# EAGLE design bdm_pod (EAGLE 4.13)
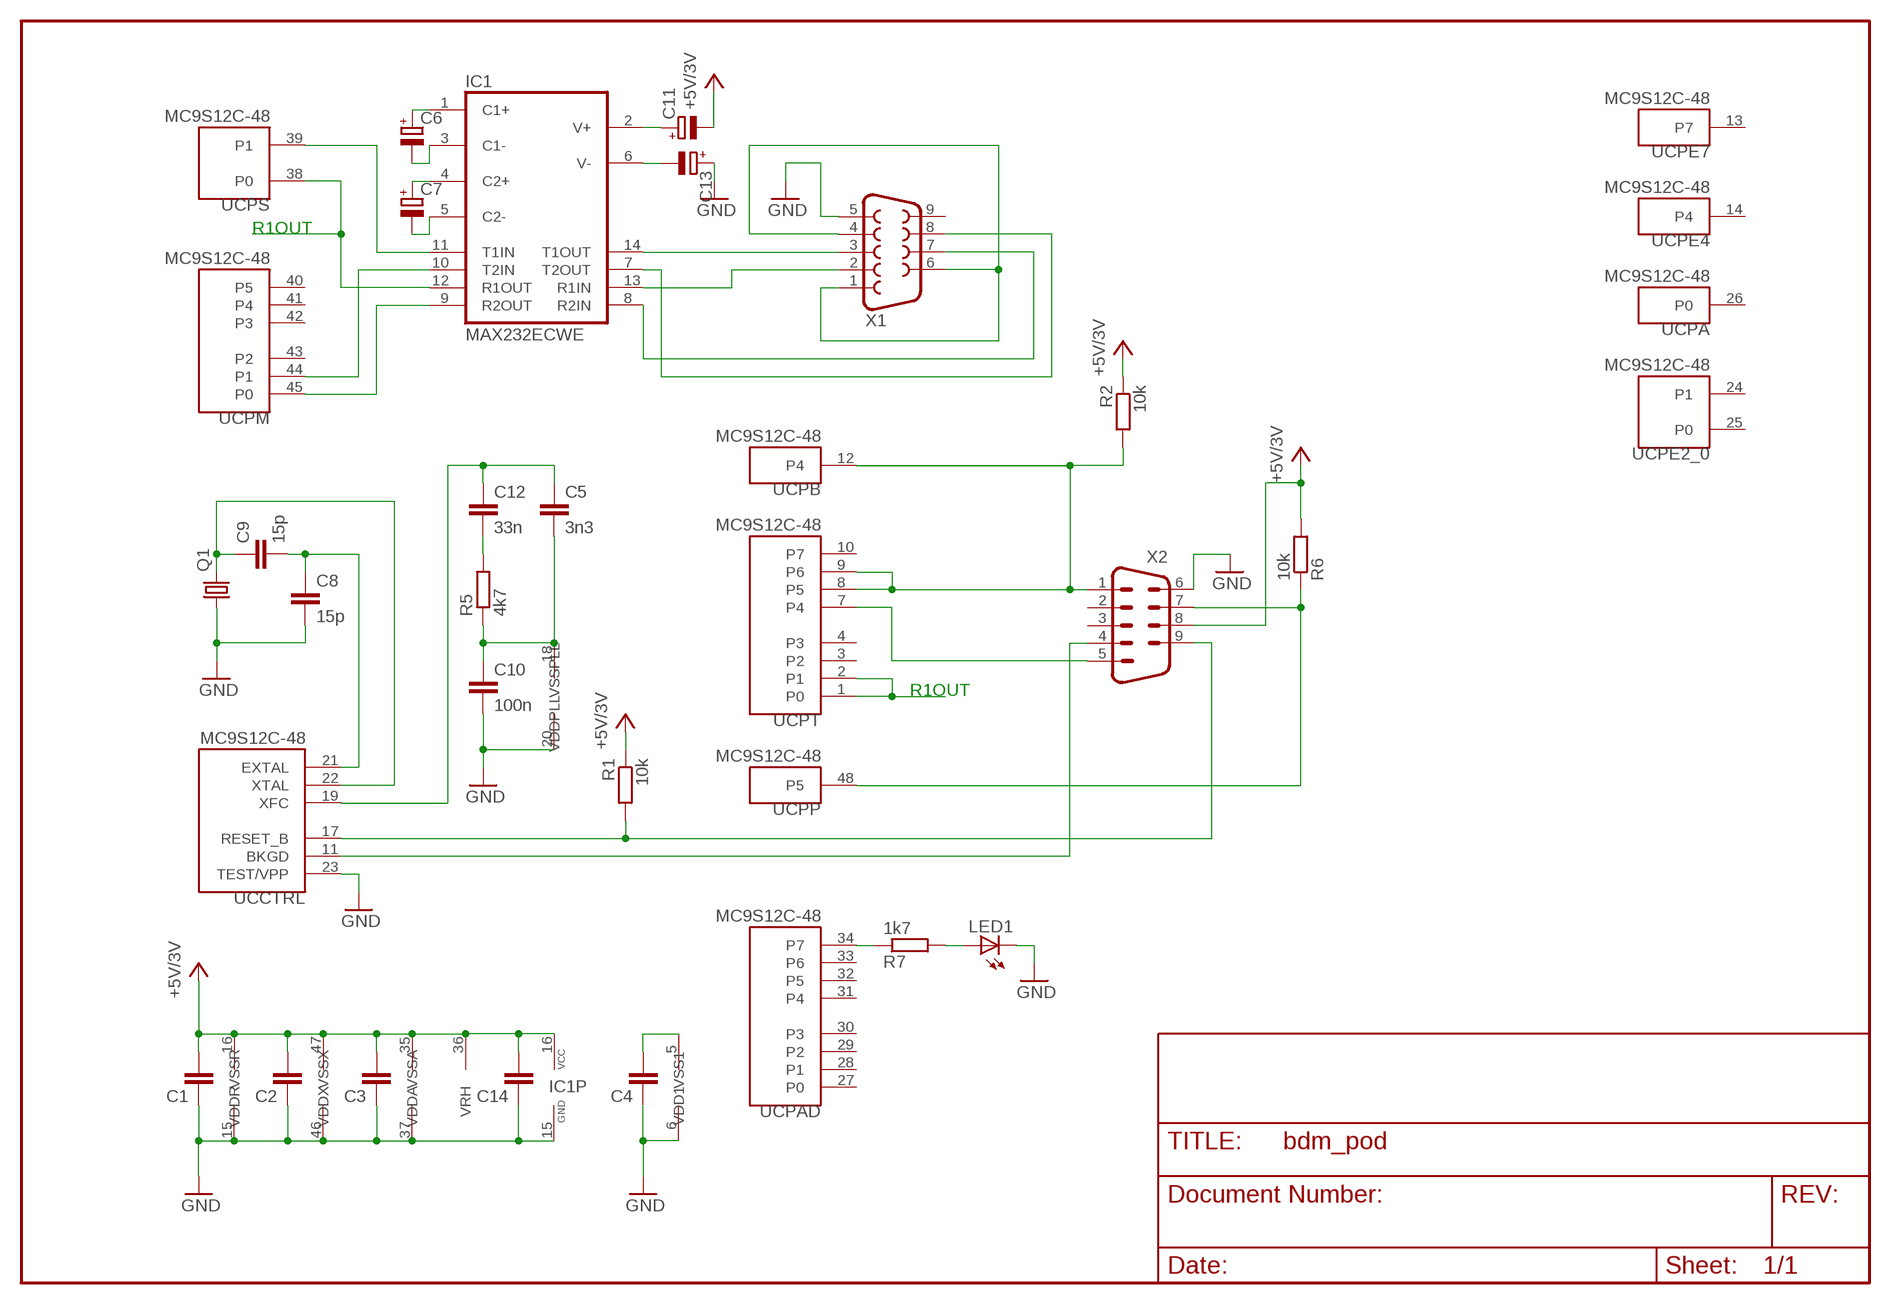
[diagram p0: schematic, sheet 1]

## Parts
C1  C-EUC0805  [C0805]
C2  C-EUC0805  [C0805]
C3  C-EUC0805  [C0805]
C4  C-EUC0805  [C0805]
C5  3n3  C-EUC0805  [C0805]
C6  CPOL-EUA  [PANASONIC_A]
C7  CPOL-EUA  [PANASONIC_A]
C8  15p  C-EUC0805  [C0805]
C9  15p  C-EUC0805  [C0805]
C10  100n  C-EUC0805  [C0805]
C11  CPOL-EUA  [PANASONIC_A]
C12  33n  C-EUC0805  [C0805]
C13  CPOL-EUA  [PANASONIC_A]
C14  C-EUC0805  [C0805]
IC1  MAX232ECWE  [SO16L]
LED1  LED3MM  [LED3MM]
Q1  CRYTALHC49S  [HC49/S]
R1  10k  R-EU_R0805  [R0805]
R2  10k  R-EU_R0805  [R0805]
R5  4k7  R-EU_R0805  [R0805]
R6  10k  R-EU_R0805  [R0805]
R7  1k7  R-EU_R0805  [R0805]
UC  MC9S12C-48  [TQFP48]
X1  F09D  [F09D]
X2  M09D  [M09D]

## Nets
+5V: C1.2 C2.2 C3.2 C11.- C14.2 IC1.16(VCC) R1.1 R2.1 R6.2 UC.16(VDD_VSS:VDDR) UC.35(VDDA_VSSA:VDDA) UC.36(VRH:VRH) UC.47(VDDX_VSSX:VDDX) X2.8 ; supply symbol labelled +5V/3V
GND: C1.1 C2.1 C3.1 C4.1 C8.2 C10.2 C13.+ C14.1 IC1.15(GND) LED1.K(C) Q1.1 UC.6(VDD1_VSS1:VSS1) UC.15(VDD_VSS:VSSR) UC.20(VDDPLL_VSSPLL:VSSPLL) UC.23(CTRL:TEST/VPP) UC.37(VDDA_VSSA:VSSA) UC.46(VDDX_VSSX:VSSX) X1.5 X2.6
N$1: R7.1 UC.34(PAD:P7)
N$2: UC.11(CTRL:BKGD) X2.4
N$3: LED1.A R7.2
N$6: C9.1 Q1.2 UC.22(CTRL:XTAL)
N$7: C12.2 R5.2
N$8: C11.+ IC1.2(V+)
N$9: C5.1 C12.1 UC.19(CTRL:XFC)
N$10: C13.- IC1.6(V-)
N$11: C7.+ IC1.4(C2+)
N$12: C7.- IC1.5(C2-)
N$13: C6.- IC1.3(C1-)
N$14: C6.+ IC1.1(C1+)
N$15: IC1.11(T1IN) UC.39(PS:P1)
N$16: IC1.14(T1OUT) X1.3
N$17: IC1.9(R2OUT) UC.45(PM:P0)
N$18: IC1.10(T2IN) UC.44(PM:P1)
N$19: IC1.13(R1IN) X1.2
N$20: X1.1 X1.4 X1.6
N$21: IC1.8(R2IN) X1.7
N$22: IC1.7(T2OUT) X1.8
N$23: R6.1 UC.48(PP:P5) X2.7
N$24: R2.2 UC.8(PT:P5) UC.9(PT:P6) UC.12(PB:P4) X2.1
N$25: UC.7(PT:P4) X2.5
N$26: C8.1 C9.2 UC.21(CTRL:EXTAL)
R1OUT: IC1.12(R1OUT) UC.1(PT:P0) UC.2(PT:P1) UC.38(PS:P0)
RESET_B: R1.2 UC.17(CTRL:RESET_B) X2.9
VDD1: C4.2 UC.5(VDD1_VSS1:VDD1)
VDDPLL: C5.2 C10.1 R5.1 UC.18(VDDPLL_VSSPLL:VDDPLL)
Unconnected: UC.3(PT:P2) UC.4(PT:P3) UC.10(PT:P7) UC.13(PE7:P7) UC.14(PE4:P4) UC.24(PE2_0:P1) UC.25(PE2_0:P0) UC.26(PA:P0) UC.27(PAD:P0) UC.28(PAD:P1) UC.29(PAD:P2) UC.30(PAD:P3) UC.31(PAD:P4) UC.32(PAD:P5) UC.33(PAD:P6) UC.40(PM:P5) UC.41(PM:P4) UC.42(PM:P3) UC.43(PM:P2) X1.9 X2.2 X2.3

## Notes on the sheet
- R1OUT
- R1OUT

## Library data of the parts
C1-C5 C8-C10 C12 C14 = rcl:C-EU: CAPACITOR, European symbol
C6 C7 C11 C13 = rcl:CPOL-EU: POLARIZED CAPACITOR, European symbol
IC1 = maxim:MAX232ECWE: RS232 TRANSEIVER
LED1 = led:LED: LED OSRAM: - CHIPLED LG R971, LG N971, LY N971, LG Q971, LY Q971, LO R971, LY R971 LH N974, LH R974 LS Q976, LO Q976, LY Q976 LO Q996 - Hyper CHIPLED LW Q18S LB Q993, LB Q99A, LB R99A - SideLED LS A670, LO A670, LY A670, LG A670, LP A670 LB A673, LV A673, LT A673, LW A673 LH A674 LY A675 LS A676, LA A676, LO A676, LY A676, LW A676 LS A679, LY A679, LG A679 - Hyper Micro SIDELED® LS Y876, LA Y876, LO Y876, LY Y876 LT Y87S - SmartLED LW L88C, LW L88S LB L89C, LB L89S, LG L890 LS L89K, LO L89K, LY L89K LS L896, LA L896, LO L896, LY L896 - TOPLED LS T670, LO T670, LY T670, LG T670, LP T670 LSG T670, LSP T670, LSY T670, LOP T670, LYG T670 LG T671, LOG T671, LSG T671 LB T673, LV T673, LT T673, LW T673 LH T674 LS T676, LA T676, LO T676, LY T676, LB T676, LH T676, LSB T676, LW T676 LB T67C, LV T67C, LT T67C, LS T67K, LO T67K, LY T67K, LW E67C LS E67B, LA E67B, LO E67B, LY E67B, LB E67C, LV E67C, LT E67C LW T67C LS T679, LY T679, LG T679 LS T770, LO T770, LY T770, LG T770, LP T770 LB T773, LV T773, LT T773, LW T773 LH T774 LS E675, LA E675, LY E675, LS T675 LS T776, LA T776, LO T776, LY T776, LB T776 LHGB T686 LT T68C, LB T68C - Hyper Mini TOPLED® LB M676 - Mini TOPLED Santana® LG M470 LS M47K, LO M47K, LY M47K Source: http://www.osram.convergy.de/
Q1 = crystal:CRYTAL: CRYSTAL
R1 R2 R5-R7 = rcl:R-EU_: RESISTOR, European symbol
UC = misc:MC9S12C-48
X1 = con-subd:F09: SUB-D
X2 = con-subd:M09: SUB-D

## Board
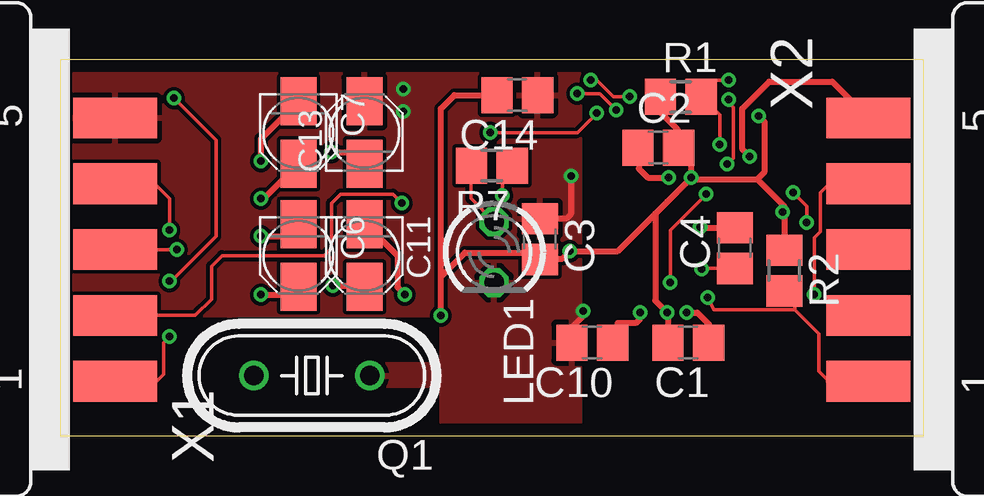
[diagram p1: board, top side]
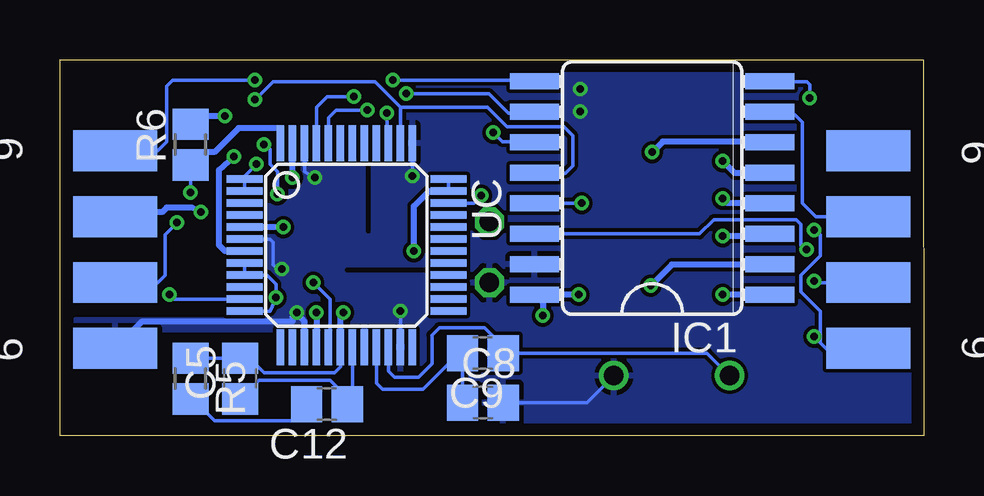
[diagram p2: board, bottom side, seen from below]

Size 36 x 15.65 mm. Coordinates in mm from the lower left corner, seen from the top.
Outline: 0,0 36,0 36,15.65 0.01,15.65 0,0
Copper layers (1*16): Top 0.035mm / dielectric 1.5mm / Bottom 0.035mm
Design rules "PCB-POOL": minimum track width 6mil, minimum drill 12mil, track to track 6mil, track to pad 6mil, pad to pad 6mil, via to via 6mil, smd to smd 6mil, copper to edge 20mil, drill to drill 8mil, minimum pad ring 8mil, minimum via ring 6mil, stop-mask expansion 3mil, vias tented up to drill 0mil, thermal gap 8mil
bRestrict: area 23.1,8.5 to 23.2,11.2; area 20.8,6.9 to 24.1,6.9

### Footprints (pad centres in the part's own frame; a part is rotated, then mirrored left to right if it is on the bottom)
C0805 = smd 1.3 x 1.5: 1 -0.85,0; 2 0.85,0
PANASONIC_A = smd 2 x 1.5: + 1.3,0; - -1.3,0
SO16L = smd 0.66 x 2.032: 1 -4.445,-4.902; 2 -3.175,-4.902; 3 -1.905,-4.902; 4 -0.635,-4.902; 5 0.635,-4.902; 6 1.905,-4.902; 7 3.175,-4.902; 8 4.445,-4.902; 9 4.445,4.902; 10 3.175,4.902; 11 1.905,4.902; 12 0.635,4.902; 13 -0.635,4.902; 14 -1.905,4.902; 15 -3.175,4.902; 16 -4.445,4.902
LED3MM = drill 0.813 octagon: A -1.27,0; K 1.27,0
HC49/S = drill 0.813 round: 1 -2.413,0; 2 2.413,0
R0805 = smd 1.3 x 1.5: 1 -0.85,0; 2 0.85,0
TQFP48 = smd 0.3 x 1.5: 1 -2.75,-4.25; 2 -2.25,-4.25; 3 -1.75,-4.25; 4 -1.25,-4.25; 5 -0.75,-4.25; 6 -0.25,-4.25; 7 0.25,-4.25; 8 0.75,-4.25; 9 1.25,-4.25; 10 1.75,-4.25; 11 2.25,-4.25; 12 2.75,-4.25; 25 2.75,4.25; 26 2.25,4.25; 27 1.75,4.25; 28 1.25,4.25; 29 0.75,4.25; 30 0.25,4.25; 31 -0.25,4.25; 32 -0.75,4.25; 33 -1.25,4.25; 34 -1.75,4.25; 35 -2.25,4.25; 36 -2.75,4.25 | smd 1.5 x 0.3: 13 4.25,-2.75; 14 4.25,-2.25; 15 4.25,-1.75; 16 4.25,-1.25; 17 4.25,-0.75; 18 4.25,-0.25; 19 4.25,0.25; 20 4.25,0.75; 21 4.25,1.25; 22 4.25,1.75; 23 4.25,2.25; 24 4.25,2.75; 37 -4.25,2.75; 38 -4.25,2.25; 39 -4.25,1.75; 40 -4.25,1.25; 41 -4.25,0.75; 42 -4.25,0.25; 43 -4.25,-0.25; 44 -4.25,-0.75; 45 -4.25,-1.25; 46 -4.25,-1.75; 47 -4.25,-2.25; 48 -4.25,-2.75
F09D = smd 1.7 x 3.5: 1 -5.486,-6.045; 2 -2.743,-6.045; 3 0,-6.045; 4 2.743,-6.045; 5 5.486,-6.045 | smd 1.7 x 3.5 bottom: 6 -4.115,-6.045; 7 -1.372,-6.045; 8 1.372,-6.045; 9 4.115,-6.045
M09D = smd 1.7 x 3.5: 1 5.486,-6.045; 2 2.743,-6.045; 3 0,-6.045; 4 -2.743,-6.045; 5 -5.486,-6.045 | smd 1.7 x 3.5 bottom: 6 4.115,-6.045; 7 1.372,-6.045; 8 -1.372,-6.045; 9 -4.115,-6.045

### Placement (x,y rotation side)
C1  26.19,3.88 180 top
C2  24.94,12 0 top
C3  20,8.19 270 top
C4  28.12,7.81 90 top
C5  28.49,2.38 90 bottom
C6  9.94,7.5 270 top
C7  9.94,12.62 270 top
C8  18.38,1.38 0 bottom
C9  18.38,3.44 180 bottom
C10  22.19,3.88 180 top
C11  12.69,7.5 270 top
C12  24.88,1.31 180 bottom
C13  12.69,12.62 90 top
C14  19.06,14.19 180 top
IC1  11.31,10.31 90 bottom
LED1  18.1,7.64 270 top
Q1  10.5,2.5 180 top
R1  25.88,14.12 0 top
R2  30.19,6.88 270 top
R5  30.56,2.38 270 bottom
R6  30.56,12.12 90 bottom
R7  18,11.25 180 top
UC  24.06,7.94 270 bottom
X1  -3.75,7.75 90 top
X2  39.75,7.75 270 top

### Tracks (layer width: path | path; a pad name or v marks a point on that pad's centre or on a via)
+5V  (via drill 0.3 pad 0.15)
  Top 0.152: v25.31,5.12 25.34,5.04 | 26.31,11.5 25.81,12 | C3.2 20,7.38 | 25.02,13.47 R1.1 | 25.81,12 C2.2 | 25.75,12.75 25.75,12.06 25.81,12
  Top 0.254: 25.34,5.04 C1.2 | v26.31,10.75 26.31,11.5 | 20,7.38 20.94,7.38 v21.25,7.69 23.25,7.69 25.31,9.75 | v26.31,10.75 26.31,10.69 29.06,10.69 | 25.31,9.75 24.81,9.25 24.81,5.62 v25.31,5.12 | 25.31,9.75 v26.31,10.75 | 29.06,10.69 29.38,11 29.38,13.06 v29.12,13.31 | 30.19,9.31 30.19,9.56 29.06,10.69 | 30.19,9.31 v30.12,9.31 | 30.19,9.31 R2.1 | 25.75,12.75 25.02,13.47 | C14.2 16.44,14.19 15.88,13.62 v15.88,5 15.88,6.62 16.88,7.62 19.69,7.62 20,7.31 C3.2 | v14.38,5.88 14.06,6.19 14.06,7.5 12.81,8.75 12.64,8.75 | 12.64,8.75 12.62,8.75 | C11.- 12.64,8.75
  Bottom 0.152: UC.36 UC.35 20.62,10.19
  Bottom 0.254: v25.31,5.12 UC.16 | v26.31,10.75 UC.47 | 20.62,10.19 21.25,9.56 v21.25,7.69 | X2.8 33.51,9.31 31.75,9.31 31.56,9.5 30.5,9.5 v30.12,9.31 | R6.2 30.56,13 30,13.31 v29.12,13.31 | 16.25,5.88 16.24,5.87 IC1.16 | IC1.16 14.38,5.87 v14.38,5.88 | IC1.16 15.88,5.53 v15.88,5
GND  (via drill 0.3 pad 0.15)
  Top 0.152: 21.81,5 v21.81,5.19 | C10.2 21.31,3.88 21.31,4.5 | 27.06,3.88 C1.1 | C4.1 26.77,6.96 v26.75,6.94 | C2.1 24.12,12 | C3.1 20,9.06
  Top 0.254: 21.31,4.5 21.81,5 | v26.12,5.12 26.56,5.12 27.06,4.62 27.06,3.88 | v25.38,10.75 24.5,10.75 24.12,11.12 24.12,12 | v21.31,10.81 21.31,9.25 21.12,9.06 20,9.06
  Bottom 0.152: Q1.1 14.04,1.38 C8.2 | v21.81,5.19 UC.23 | v26.75,6.94 26.94,6.94 27.12,7.12 27.12,8.06 27.25,8.19 UC.6 | UC.46 25.81,11 v25.38,10.75 | v21.31,10.81 UC.37
  Bottom 0.254: UC.15 25.81,4.75 v26.12,5.12 26.31,4.94 26.31,4.75 32.59,4.75 X2.6
  other vias: 14.31,14.44 14.31,13.5
  pour Bottom: 20.56,10.81 20.56,5.06 21.19,4.44 26.94,4.44 27.56,5.06 27.56,10.81 26.94,11.44 21.19,11.44
  pour Bottom: 0,15.62 0,0 15.88,0 21.94,0 21.94,15.62
  pour Top: 0,15.62 0,0 5.19,0 5.19,5 15.88,5 15.88,3 12.38,3 12.38,2.06 15.88,2.06 15.88,0 21.69,0 21.69,15.69 0.06,15.69
  pour Bottom: 27.19,4.38 32.06,4.38 32.06,3.19 35.38,3.19 35.38,4.88 27.19,4.88
N$1  (via drill 0.3 pad 0.15)
  Top 0.152: R7.1 18.85,11.22 18.44,10.81 v18.44,10
  Bottom 0.152: UC.34 18.75,9.69 v18.44,10
N$2  (via drill 0.3 pad 0.15)
  Top 0.152: v31.44,5.88 31.44,8.25 31.69,8.5 31.69,10.12 32,10.44 33.69,10.44 33.74,10.49 | 33.74,10.49 33.75,10.5 | 33.74,10.49 X2.4
  Bottom 0.152: UC.11 31.25,5.69 v31.44,5.88
N$3
  Top 0.152: R7.2 17.12,11.25 17.12,9.88 LED1.A
N$6
  Bottom 0.152: Q1.2 9.02,3.44 C9.1 | 17.52,3.71 18.31,4.5 20.19,4.5 20.5,4.19 20.5,3 21.06,2.44 22.06,2.44 22.31,2.69 UC.22
  Bottom 0.254: C9.1 17.52,3.4 | C9.1 17.52,3.84 | C9.1 17.52,3.71
N$7
  Bottom 0.152: R5.2 30.46,1.52 29.56,0.62 26.38,0.62 25.69,1.31 C12.2
N$8  (via drill 0.3 pad 0.15)
  Top 0.254: C11.+ 12.64,6.25 v11.38,6.25
  Bottom 0.254: IC1.2 6.42,7.12 10.5,7.12 v11.38,6.25
N$9
  Bottom 0.152: C12.1 23.81,1.52 | C5.1 27.7,2.31 24.75,2.31 24.02,1.59 C12.1 | C12.1 24,1.31 23.81,1.5 UC.19
N$10  (via drill 0.3 pad 0.15)
  Top 0.254: C13.- 12.2,11.81 v11.31,11.81
  Bottom 0.254: IC1.6 6.44,12.24 6.44,12.25 10.88,12.25 v11.31,11.81
N$11  (via drill 0.3 pad 0.15)
  Top 0.254: C7.+ 8.49,9.88 v8.38,9.88
  Bottom 0.254: IC1.4 8.19,9.69 v8.38,9.88
N$12  (via drill 0.3 pad 0.15)
  Top 0.254: C7.- 8.38,12.36 v8.38,11.44
  Bottom 0.254: 6.4,10.94 6.38,10.94 | IC1.5 6.4,10.94 | v8.38,11.44 7.88,10.94 6.4,10.94
N$13  (via drill 0.3 pad 0.15)
  Top 0.254: C6.- 9.45,8.31 v8.38,8.31
  Bottom 0.254: IC1.3 6.44,8.38 6.44,8.31 v8.38,8.31
N$14  (via drill 0.3 pad 0.15)
  Top 0.254: C6.+ 9.61,5.88 v8.38,5.88
  Bottom 0.254: IC1.1 v8.38,5.88
N$15  (via drill 0.3 pad 0.15)
  Top 0.152: v22.38,13.44 21.56,12.62 v17.94,12.62
  Bottom 0.152: UC.39 22.31,12.38 22.38,12.44 v22.38,13.44 | IC1.11 16.19,12.24 16.19,12.25 17.56,12.25 v17.94,12.62
N$16  (via drill 0.3 pad 0.15)
  Top 0.152: 2.25,7.75 X1.3 v4.88,7.75
  Bottom 0.152: IC1.14 9.34,8.41 8.75,9 5.31,9 5.12,8.81 5.12,7.94 v4.88,7.75
N$17  (via drill 0.3 pad 0.15)
  Top 0.152: v23.75,14.12 23.06,14.12 22.38,14.81 v22.12,14.81
  Bottom 0.152: UC.45 25.31,13.69 24.88,14.12 v23.75,14.12 | 16.21,14.71 16.19,14.69 | IC1.9 16.21,14.71 | v22.12,14.81 16.38,14.81 16.21,14.71
N$18  (via drill 0.3 pad 0.15)
  Top 0.152: v23.19,13.56 22.5,14.25 v21.56,14.25
  Bottom 0.152: UC.44 24.81,13.25 24.5,13.56 v23.19,13.56 | v21.56,14.25 18.12,14.25 17.31,13.44 16.25,13.44 16.21,13.47 IC1.10
N$19  (via drill 0.3 pad 0.15)
  Top 0.152: X1.2 5.63,5.01 6.31,5.69 6.31,7.06 6.75,7.5 11,7.5 11.31,7.81 11.31,9.69 11.69,10.06 13.88,10.06 v14.25,9.69
  Bottom 0.152: IC1.13 16.36,9.68 16.38,9.69 v14.25,9.69
N$20  (via drill 0.3 pad 0.15)
  Top 0.152: X1.4 3.94,10.49 4.56,9.88 v4.56,8.56 | v4.56,4.12 4.31,3.88 4.31,2.56 4,2.25 2.31,2.25 X1.1
  Bottom 0.152: v4.56,8.56 4.31,8.38 4.31,7.5 5.12,6.69 5.12,6 4.31,5.19 4.31,3.88 4.06,3.62 | X1.6 2.31,3.62 4.06,3.62 | v4.56,4.12 4.06,3.62
N$21  (via drill 0.3 pad 0.15)
  Top 0.152: v4.56,6.44 4.62,6.44 6.5,8.31 6.5,12.31 v4.75,14.06
  Bottom 0.152: X1.7 4.38,6.38 v4.56,6.44 | v4.75,14.06 4.75,14.62 4.88,14.75 6.5,14.75 6.49,14.76 IC1.8
N$22
  Bottom 0.152: X1.8 4.5,9.12 5.06,9.69 5.06,13.06 5.44,13.44 6.44,13.44 6.49,13.49 | 6.49,13.49 6.5,13.5 | 6.49,13.49 IC1.7
N$23  (via drill 0.3 pad 0.15)
  Top 0.152: v30.56,10.12 31.12,9.56 v31.12,8.88
  Bottom 0.152: 30.62,11.25 30.59,11.25 R6.1 v30.56,10.12 | v31.12,8.88 31.62,8.38 31.62,6.69 31.94,6.38 33.69,6.38 X2.7
  Bottom 0.254: UC.48 26.81,12.81 28.56,12.81 29.56,11.81 30.02,11.81 R6.1
N$24  (via drill 0.3 pad 0.15)
  Top 0.152: 32.05,2.26 31.62,2.69 31.62,4.25 30.62,5.25 | 30.62,5.25 30.62,5.94 | 30.56,6 30.25,5.69 | v27,5.75 27.25,5.25 30.62,5.25
  Top 0.254: 32.05,2.26 X2.1 | R2.2 30.56,6 30.62,5.94
  Bottom 0.152: UC.12 27.25,5.19 v27,5.75 27,6.31 27.38,6.69 UC.9 UC.8
N$25  (via drill 0.3 pad 0.15)
  Top 0.254: v28.75,11.62 28.44,11.94 28.44,13.62 29.56,14.75 32.19,14.75 33.75,13.19 X2.5
  Bottom 0.254: UC.7 29.12,7.69 29.38,7.94 29.38,11.06 v28.75,11.62
N$26
  Bottom 0.152: 19.38,3.44 20.88,1.94 22.56,1.94 22.81,2.19 UC.21 | C8.1 19.23,3.41
  Bottom 0.254: 19.25,3.44 19.38,3.44 | 19.25,3.44 C9.2 | 19.23,3.41 19.25,3.44
R1OUT  (via drill 0.3 pad 0.15)
  Top 0.152: v27.81,11.31 28.06,11.56 28.06,13.69 27.88,13.88 v27.88,14
  Bottom 0.152: UC.2 28.31,10.62 28.38,10.69 UC.1 28.44,10.69 v27.81,11.31 | v27.88,14 27.12,14.75 22.88,14.75 21.81,13.69 | 21.81,13.69 UC.38 | 21.81,13.69 18.19,13.69 17.38,12.88 15,12.88 14.62,12.5 14.62,11.25 14.94,10.94 16.19,10.94 16.2,10.95 IC1.12
RESET_B  (via drill 0.3 pad 0.15)
  Top 0.152: v27.88,14.81 27.06,14.81 27.05,14.8 27.05,14.12 R1.2 26.75,14.12 27.5,13.38 v27.5,12.12 | v25.44,6.38 25.44,8.56 v26.94,10.06
  Bottom 0.152: v27.88,14.81 31.31,14.81 31.56,14.56 31.56,12.25 31.94,11.88 33.62,11.88 33.69,11.81 33.7,11.83 X2.9 | UC.17 24.75,3.69 24.75,5.69 v25.44,6.38 | v26.94,10.06 26.94,11 27.25,11.31 27.25,11.94 v27.5,12.12
VDD1  (via drill 0.3 pad 0.15)
  Top 0.152: v26.69,8.69 26.59,8.66
  Top 0.254: 26.59,8.66 C4.2
  Bottom 0.254: v26.69,8.69 UC.5
VDDPLL  (via drill 0.3 pad 0.15)
  Top 0.152: 23.25,4.69 23.06,4.5 23.06,3.88 C10.1
  Top 0.254: v24.19,5.12 24.19,4.88 24,4.69 23.25,4.69
  Bottom 0.152: R5.1 28.52,3.23 28.5,3.25 C5.2 28.1,3.23 27.5,2.62 24.56,2.62 24.31,2.88 UC.18 | 24.31,5.06 v24.19,5.12
  Bottom 0.254: UC.18 24.31,5.06